# EAGLE schematic Configurable_DOMINATOR (EAGLE 9.0.1)
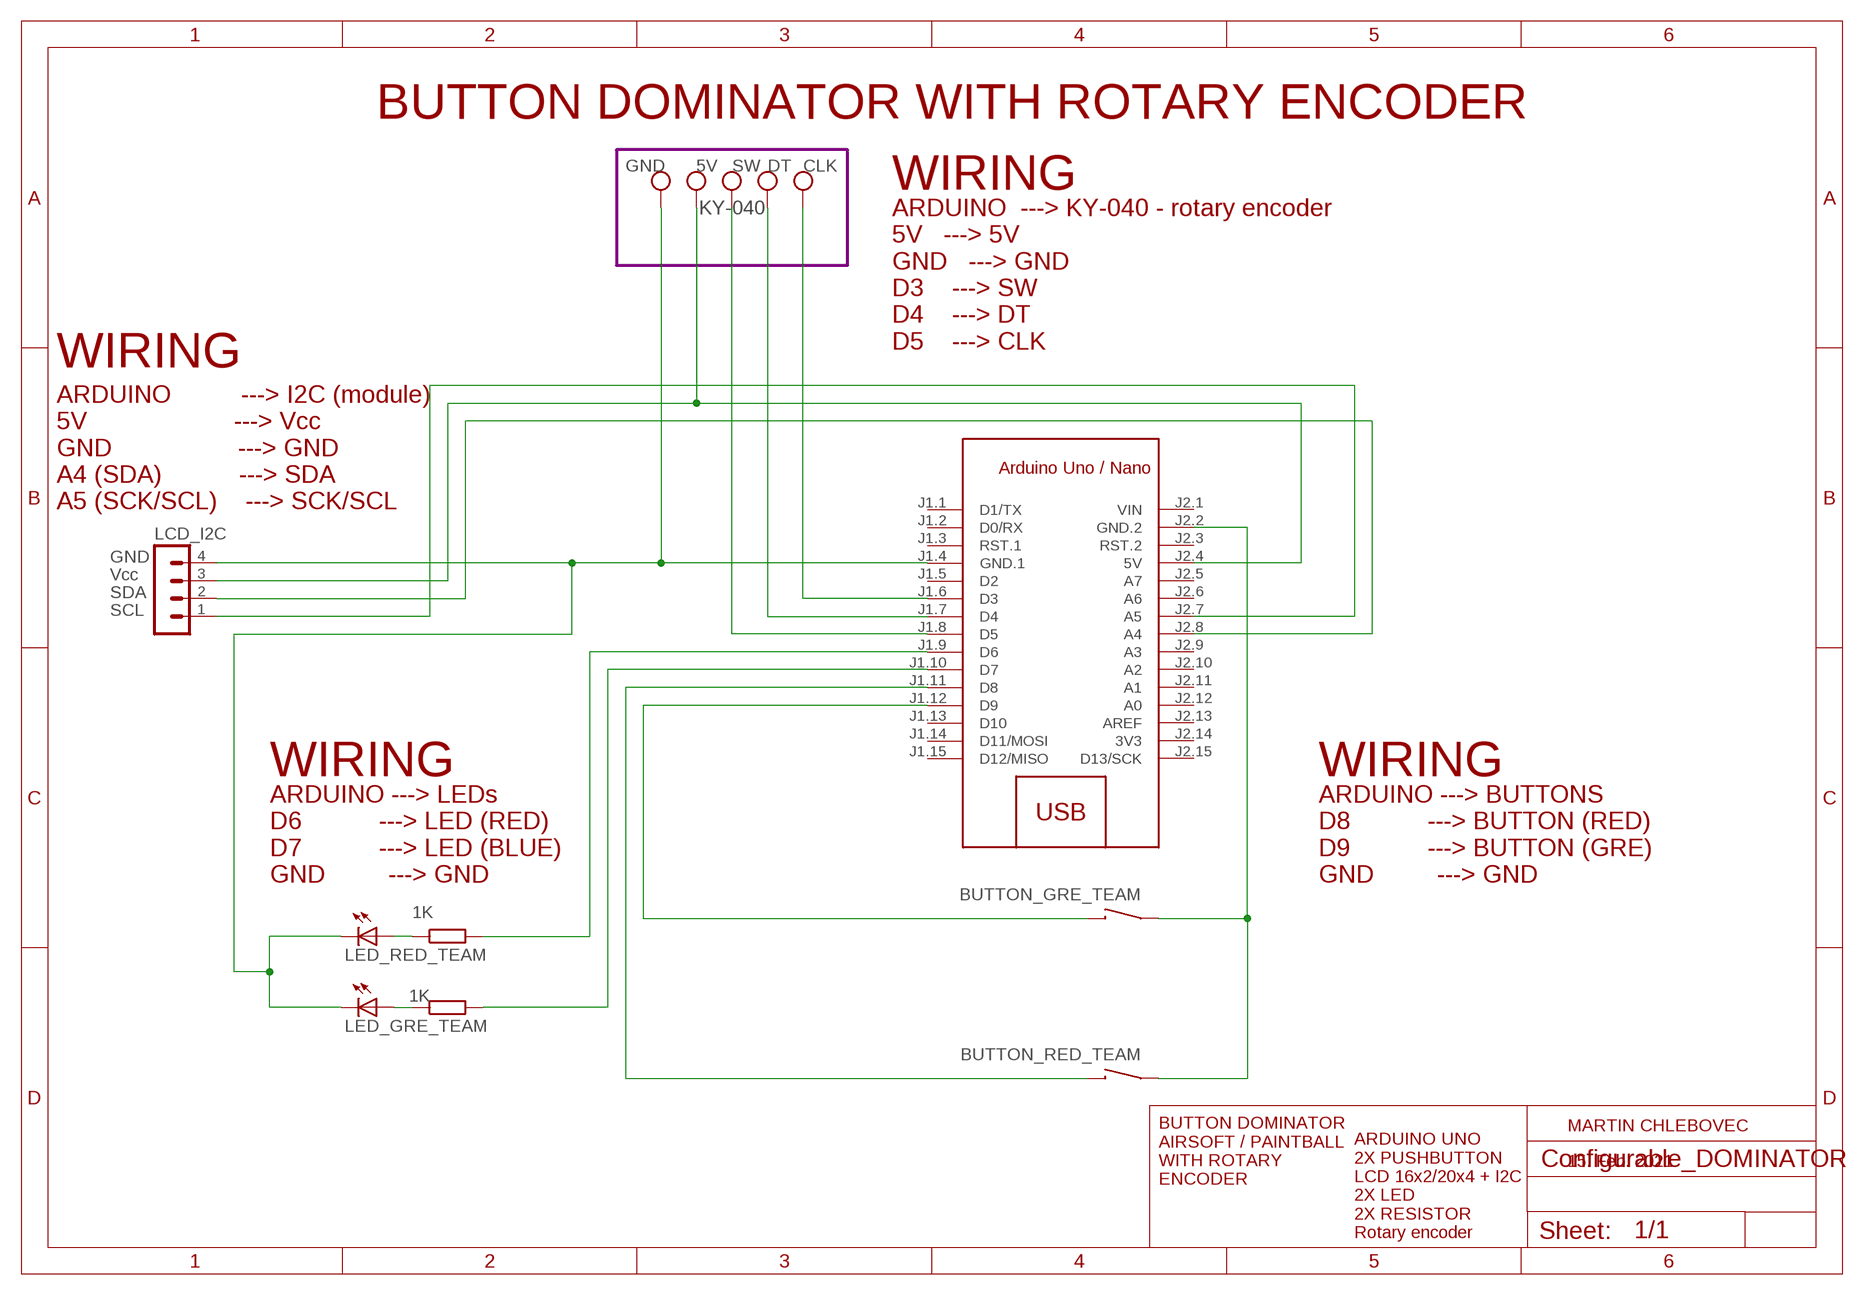
[diagram p0: schematic, sheet 1]

## Parts
BUTTON_GRE_TEAM  FINGERPAD-2B  [FINGERPAD-2B]
BUTTON_RED_TEAM  FINGERPAD-2B  [FINGERPAD-2B]
LCD_I2C  MA04-1  [MA04-1]
LED_GRE_TEAM  LED3MM  [LED3MM]
LED_RED_TEAM  LED3MM  [LED3MM]
M1  ARDUINO-NANO-3.0  [ARDUINO-NANO-3.0]

## Module instances
KY-040 = KY-040

## Nets
N$1: BUTTON_GRE_TEAM.1 BUTTON_RED_TEAM.1 M1.J2.2(GND.2)
N$2: M1.J1.10(D7)
N$3: M1.J1.9(D6)
N$6: BUTTON_RED_TEAM.2 M1.J1.11(D8)
N$7: BUTTON_GRE_TEAM.2 M1.J1.12(D9)
N$10: LCD_I2C.1 M1.J2.7(A5)
N$14: LED_GRE_TEAM.A
N$15: LED_RED_TEAM.A
N$16: LCD_I2C.2 M1.J2.8(A4)
VEE: LCD_I2C.3 LCD_I2C.4 LED_GRE_TEAM.K(C) LED_RED_TEAM.K(C) M1.J1.4(GND.1) M1.J1.6(D3) M1.J1.7(D4) M1.J1.8(D5) M1.J2.4(5V)
Unconnected: M1.J1.1(D1/TX) M1.J1.2(D0/RX) M1.J1.3(RST.1) M1.J1.5(D2) M1.J1.13(D10) M1.J1.14(D11/MOSI) M1.J1.15(D12/MISO) M1.J2.3(RST.2) M1.J2.5(A7) M1.J2.6(A6) M1.J2.9(A3) M1.J2.10(A2) M1.J2.11(A1) M1.J2.12(A0) M1.J2.13(AREF) M1.J2.15(D13/SCK)

## Notes on the sheet
- BUTTON DOMINATOR WITH ROTARY ENCODER
- GND | 5V | SW | DT | CLK
- WIRING
- ARDUINO  ---> KY-040 - rotary encoder
  5V   ---> 5V
  GND   ---> GND
  D3    ---> SW
  D4    ---> DT
  D5    ---> CLK
- WIRING
- Arduino Uno / Nano
- ARDUINO          ---> I2C (module)
  5V                     ---> Vcc
  GND                  ---> GND
  A4 (SDA)           ---> SDA
  A5 (SCK/SCL)    ---> SCK/SCL
- GND
- Vcc
- SDA
- SCL
- WIRING | WIRING
- ARDUINO ---> LEDs
  D6           ---> LED (RED)
  D7           ---> LED (BLUE)
  GND         ---> GND
- ARDUINO ---> BUTTONS
  D8           ---> BUTTON (RED)
  D9           ---> BUTTON (GRE)
  GND         ---> GND
- 1K
- 1K
- MARTIN CHLEBOVEC
- 15. Feb. 2021
- BUTTON DOMINATOR
  AIRSOFT / PAINTBALL
  WITH ROTARY 
  ENCODER
- ARDUINO UNO
  2X PUSHBUTTON
  LCD 16x2/20x4 + I2C
  2X LED
  2X RESISTOR
  Rotary encoder

## Power pins joined to a net without a drawn wire
3V3: M1.J2.14(3V3)
VIN: M1.J2.1(VIN)

## Library data of the parts
BUTTON_GRE_TEAM BUTTON_RED_TEAM = dom-key:FINGERPAD-2B: Source: http://www.polycase.com/uploads/14531129045666549.pdf
LCD_I2C = con-lstb:MA04-1: PIN HEADER; OC_FARNELL: unknown; OC_NEWARK: unknown; SPICEPREFIX: S
LED_GRE_TEAM LED_RED_TEAM = adafruit:LED: LED OSRAM: - CHIPLED LG R971, LG N971, LY N971, LG Q971, LY Q971, LO R971, LY R971 LH N974, LH R974 LS Q976, LO Q976, LY Q976 LO Q996 - Hyper CHIPLED LW Q18S LB Q993, LB Q99A, LB R99A - SideLED LS A670, LO A670, LY A670, LG A670, LP A670 LB A673, LV A673, LT A673, LW A673 LH A674 LY A675 LS A676, LA A676, LO A676, LY A676, LW A676 LS A679, LY A679, LG A679 - Hyper Micro SIDELED® LS Y876, LA Y876, LO Y876, LY Y876 LT Y87S - SmartLED LW L88C, LW L88S LB L89C, LB L89S, LG L890 LS L89K, LO L89K, LY L89K LS L896, LA L896, LO L896, LY L896 - TOPLED LS T670, LO T670, LY T670, LG T670, LP T670 LSG T670, LSP T670, LSY T670, LOP T670, LYG T670 LG T671, LOG T671, LSG T671 LB T673, LV T673, LT T673, LW T673 LH T674 LS T676, LA T676, LO T676, LY T676, LB T676, LH T676, LSB T676, LW T676 LB T67C, LV T67C, LT T67C, LS T67K, LO T67K, LY T67K, LW E67C LS E67B, LA E67B, LO E67B, LY E67B, LB E67C, LV E67C, LT E67C LW T67C LS T679, LY T679, LG T679 LS T770, LO T770, LY T770, LG T770, LP T770 LB T773, LV T773, LT T773, LW T773 LH T774 LS E675, LA E675, LY E675, LS T675 LS T776, LA T776, LO T776, LY T776, LB T776 LHGB T686 LT T68C, LB T68C - Hyper Mini TOPLED® LB M676 - Mini TOPLED Santana® LG M470 LS M47K, LO M47K, LY M47K Source: http://www.osram.convergy.de/
M1 = diy-modules:ARDUINO-NANO-3.0: Arduino Nano 3.0 and compatible devices More details available here: https://www.arduino.cc/en/Main/ArduinoBoardNano Click here to find device on ebay.com <http://www.ebay.com/sch/arduino+nano>

## Module KY-040
Ports: 

### Library data of the parts